# Altium project CarrierBoard.PrjPcb
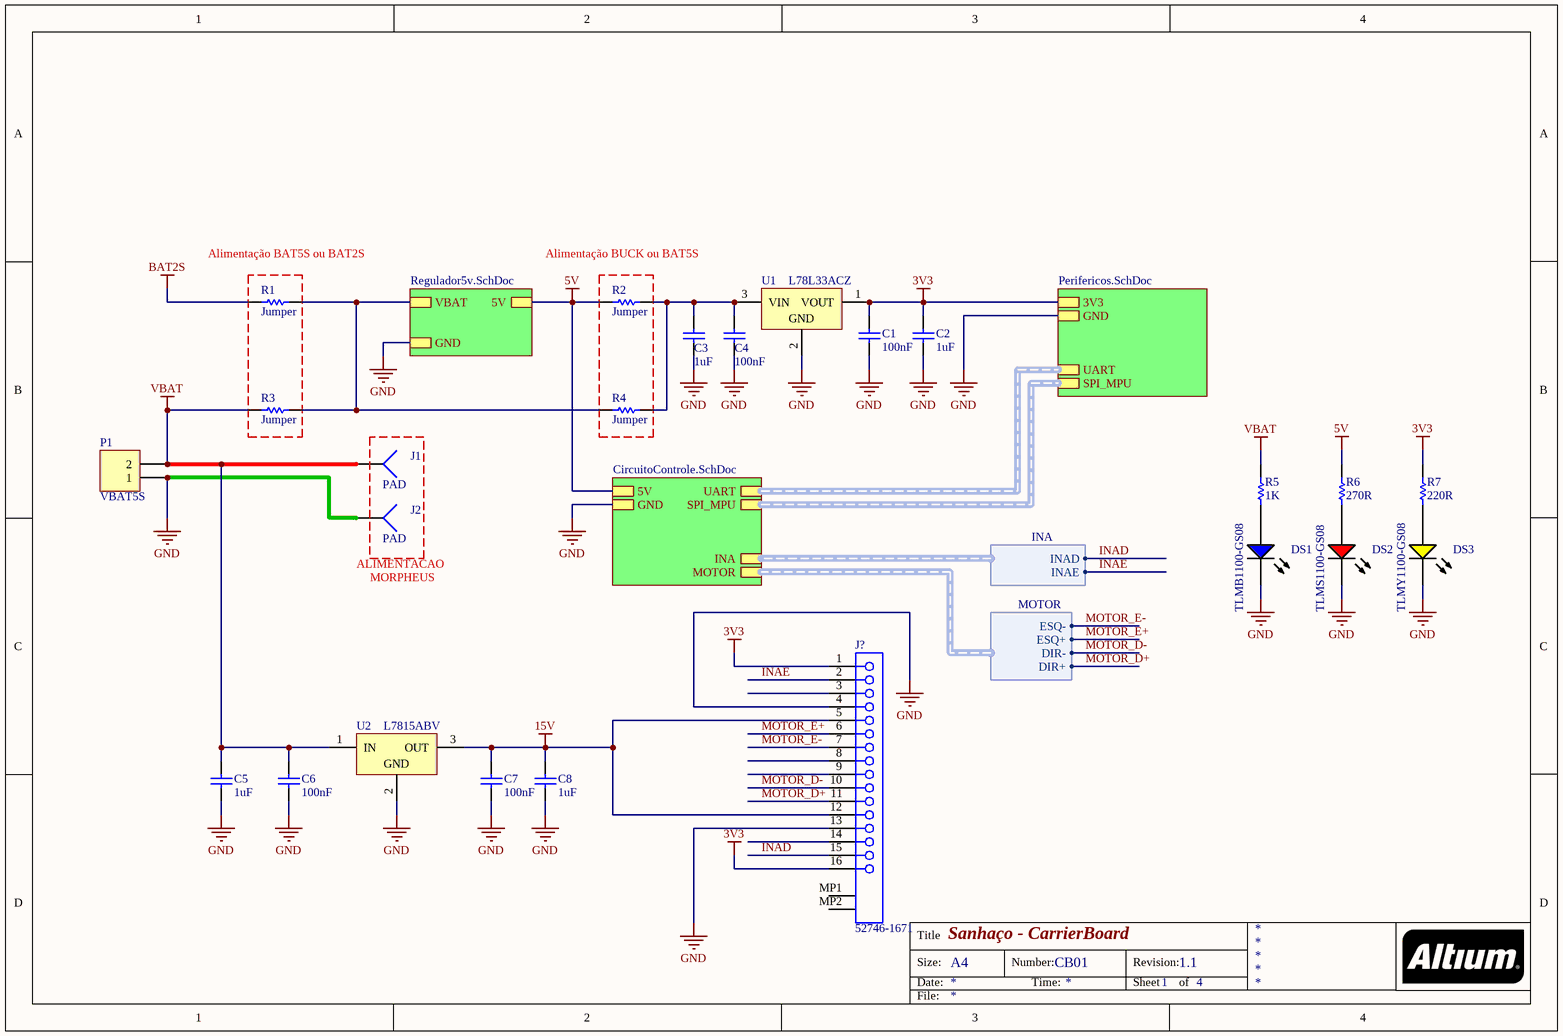
[diagram p0: CarrierBoard.SchDoc]
3 sheets, 55 parts. Net scope: hierarchical (ports join the sheet entries above them; power ports are global).
Sheets:
  CarrierBoard.SchDoc
    Designator = Regulador5V.SchDoc
    Designator = CircuitoControle.SchDoc

## Sheet CarrierBoard.SchDoc: Sanhaço - CarrierBoard
size A4; DocumentNumber: CB01; Revision: 1.1; SheetNumber: 1; SheetTotal: 4; ProjectName: CarrierBoard - Sanhaço

### Parts
C1  100nF  [CAPC0805(2012)145_N]
C2  1uF  [CAPC0805(2012)145_L]
C3  1uF  [CAPC0805(2012)145_L]
C4  100nF  [CAPC0805(2012)145_N]
C5  1uF  [CAPC0805(2012)145_L]
C6  100nF  [CAPC0805(2012)145_N]
C7  100nF  [CAPC0805(2012)145_N]
C8  1uF  [CAPC0805(2012)145_L]
DS1  TLMB1100-GS08  [VISH-TLMX1100-2_V]
DS2  TLMS1100-GS08  [VISH-TLMX1100_V]
DS3  TLMY1100-GS08  [VISH-TLMX1100-2_V]
J1  PAD  [PIN1]
J2  PAD  [PIN1]
J?  52746-1671  [MOLX-52746-1671]
P1  VBAT5S  [HDR1X2]
R1  Jumper  [RESC0805(2012)_N]
R2  Jumper  [RESC0805(2012)_N]
R3  Jumper  [RESC0805(2012)_N]
R4  Jumper  [RESC0805(2012)_N]
R5  1K  [RESC0805(2012)_N]
R6  270R  [RESC0402(1005)_N]
R7  220R  [RESC0805(2012)_N]
U1  L78L33ACZ  [TO-92]
U2  L7815ABV  [TO220]

### Sub-sheets
Designator = Regulador5v.SchDoc: VBAT, 5V, GND
Designator = Perifericos.SchDoc (file not in this document): 3V3, GND, SPI_MPU (harness SPI_MPU), UART (harness UART)
Designator = CircuitoControle.SchDoc: 5V, GND, UART (harness UART), SPI_MPU (harness SPI_MPU), MOTOR (harness MOTOR), INA (harness INA)

### Harnesses
INA: INAD, INAE
MOTOR: ESQ+, DIR-, DIR+, ESQ-

### Nets
3V3: C1.2 C2.2 J?.1 J?.16 R7.2 U1.1(VOUT) ; sheet Designator/3V3
5V: R2.1 R6.2 ; sheet Designator/5V, sheet Designator/5V
15V: C7.2 C8.2 J?.5 J?.12 U2.3(OUT)
BAT2S: R1.1
GND: C1.1 C2.1 C3.1 C4.1 C5.1 C6.1 C7.1 C8.1 DS1.2(K) DS2.2(K) DS3.2(K) J2.1 J?.4 J?.13 P1.1 U1.2(GND) U2.2(GND) ; sheet Designator/GND, sheet Designator/GND, sheet Designator/GND
VBAT: C5.2 C6.2 J1.1 P1.2 R3.1 R5.2 U2.1(IN)
INAD: J?.15 ; sheet Designator/INA.INAD
INAE: J?.2 ; sheet Designator/INA.INAE
MOTOR_D+: J?.11 ; sheet Designator/MOTOR.DIR+
MOTOR_D-: J?.10 ; sheet Designator/MOTOR.DIR-
MOTOR_E+: J?.6 ; sheet Designator/MOTOR.ESQ+
MOTOR_E-: J?.7 ; sheet Designator/MOTOR.ESQ-
NetC3_2: C3.2 C4.2 R2.2 R4.2 U1.3(VIN)
NetC13_2: R1.2 R3.2 R4.1 ; sheet Designator/VBAT
NetDS1_1: DS1.1(A) R5.1
NetDS2_1: DS2.1(A) R6.1
NetDS3_1: DS3.1(A) R7.1

Not connected (* = marked no-connect by the designer): J? 3 8 9 14 MP1 MP2

### Notes on the sheet
- (near R1) Alimentação BAT5S ou BAT2S
- (near R2) Alimentação BUCK ou BAT5S
- (near J2) ALIMENTACAO
- MORPHEUS
- Title
- Size:
- Date:
- A4
- Number:
- Time:
- Revision:
- Sheet
- of
- File:

### Library data of the parts
C1 C4 C6 C7 = CMP-1036-04417-1: CAP 100nF 50V ±5% 0805 (2012 Metric) Thickness 1.45mm SMD; Case-Metric: 2012; Tolerance: Â±5%; Case-EIA: 0805; Max Thickness: 1.45 mm; Rated Voltage: 50 V; Value: 100nF; Technology: SMT
C2 C3 C5 C8 = CMP-1036-04761-1: CAP 1uF 50V ±10% 0805 (2012 Metric) Thickness 1.45mm SMD; Tolerance: Â±10%; Case-EIA: 0805; Case-Metric: 2012; Technology: SMT; Value: 1uF; Max Thickness: 1.45 mm; Rated Voltage: 50 V
DS1 = CMP-1666-00028-1: Blue LED, 10 mA, 3.9 V, -40 to 100 degC, 2-Pin SMD (0603), RoHS, Tape and Reel                  TLMB1100-GS08; Tolerance: 10%; Voltage Rating: 100 V; Capacitance: 10 nF; Type (Capacitors): X7R; Case\Package: Radial; ComponentLink1Description: Manufacturer URL; REACH SVHC: No SVHC; Package Quantity: 500; PackageDescription: 2-Pin Surface Mount Device, Body 1.6 x 0.8 mm; Pins: 2; ComponentLink2URL: http://download.siliconexpert.com/pdfs/2016/8/7/12/43/26/667/vsh_/manual/379263299541529tlmb1100.pdf; RoHSCompliant: true; Lead Pitch: 2.54 mm; Height: 2.54 mm; DatasheetVersion: Rev. 2.7, 03/2016; Length: 5.33 mm; ComponentLink1URL: http://www.vishay.com/; Min Operating Temperature: -55 degC; PackageReference: 0603; Packaging: Bulk; ComponentLink2Description: Datasheet; Max Operating Temperature: 125 degC; Radiation Hardening: No; Width: 3.81 mm; Mount: Through Hole
DS2 = CMP-1666-00027-1: LED, RED, 2.1 V, -40 to 100 degC, 2-Pin SMD (0603), RoHS, Tape and Reel; Type (Capacitors): C0G; Resistance: 100000000000 Ohm; Capacitance: 12 pF; Voltage Rating: 50 V; Tolerance: 5%; Min Operating Temperature: -55degC; REACH SVHC: No SVHC; ComponentLink2Description: Datasheet; ComponentLink1URL: http://www.vishay.com/; Width: 0.8 mm; Package Quantity: 4000; PackageReference: TLMX1100; ComponentLink2URL: http://www.vishay.com/docs/83173/tlmb1100.pdf; Case/Package: 0603; Case Code (Metric): 1608; Packaging: Tape and Reel; Pins: 2; ComponentLink1Description: Manufacturer URL; Max Operating Temperature: 125degC; Height: 0.8 mm; Length: 1.6 mm; Mount: Surface Mount; PackageDescription: 2-Pin Surface Mount Device, Body 1.6 x 0.8 mm; DatasheetVersion: Rev. 2.7, 03/2016; Case Code (Imperial): 0603; Voltage Rating (DC): 50 V; RoHSCompliant: True; Radiation Hardening: No
DS3 = CMP-1666-00030-1: Yellow LED, 20 mA, 2.1 V, -40 to 100 degC, 2-Pin SMD (0603), RoHS, Tape and Reel             TLMY1100-GS08; ComponentLink2Description: Datasheet; ComponentLink2URL: http://download.siliconexpert.com/pdfs/2016/8/7/12/43/26/667/vsh_/manual/379263299541529tlmb1100.pdf; ComponentLink1Description: Manufacturer URL; PackageDescription: 2-Pin Surface Mount Device, Body 1.6 x 0.8 mm; DatasheetVersion: Rev. 2.7, 03/2016; ComponentLink1URL: http://www.vishay.com/; PackageReference: 0603
J1 J2 = Socket: LatestRevisionDate: 17-Jul-2002; LatestRevisionNote: Re-released for DXP Platform.; Publisher: Altium Limited
J? = CMP-1241-00378-1: 0.5 mm Pitch Easy-On(TM) Type FPC Connector, 2.0 mm Mated Height, Right Angle, ZIF, SMT, Bottom Contact, 16 Circuits, -20 to 85 degC, ELV and RoHS Compliant, Tape and Reel; Manufacturer: Molex; Voltage (Max): 50V; Durability (mating cycles max): 20; Current (Max per Contact): 0.5A; Pitch - Mating Interface: 0.50mm; PCB Retention: Yes; Stackable: No; Circuits (Loaded): 16; Material - Plating Termination: Gold; Mated Height: 2.00mm; Material - Metal: Phosphor Bronze; Entry Angle: 90degrees Angle; PackageVersion: Rev. H, 05/2009; ComponentLink1URL: http://www.molex.com/molex/index.jsp; PackageReference: 52746-1671; Contact Position: Bottom; Packing: Tape and Reel; Number of Rows: 1; ComponentLink1Description: Manufacturer URL; Mounting Technology: Surface Mount; RoHS: TRUE; Polarized to PCB: Yes; PackageDescription: 16-Lead FPC Connector, Pitch 0.5 mm; ComponentLink3Description: Package Specification; Material - Plating Mating: Gold; ComponentLink3URL: http://www.molex.com/pdm_docs/sd/527461671_sd.pdf; ComponentLink2Description: Datasheet; Orientation: Right Angle; PCB Locator: No; ComponentLink2URL: http://www.molex.com/webdocs/datasheets/pdf/en-us/0527461671_FFC_FPC_CONNECTORS.pdf; PartNumber: 52746-1671
P1 = Header 2: Header, 2-Pin; LatestRevisionDate: 17-Jul-2002; LatestRevisionNote: Re-released for DXP Platform.; Publisher: Altium Limited
R1-R4 = CMP-1013-00001-1: Jumper 0805 (2012 Metric); Case-EIA: 0805; Value: 0.00 Ohm; Tolerance: None; Case-Metric: 2012; Technology: SMT; Power: None
R5 = CMP-1013-00074-1: 1K 0.125W 5% 0805 (2012 Metric)  SMD                                667-ERJ-P06J102V; Case-EIA: 0805; Case-Metric: 2012; Power: 0.500 W; Value: 1000.00 Ohm; Technology: SMT; Tolerance: 5 %
R6 = CMP-1011-00060-1: 270R 0.063W 5% 0402 (1005 Metric)  SMD                             603-AC0402JR-07270RL; Case-Metric: 1005; Value: 270.00 Ohm; Case-EIA: 0402; Tolerance: 5 %; Technology: SMT; Power: 0.063 W
R7 = CMP-1013-00058-1: 220R 0.125W 5% 0805 (2012 Metric)  SMD                               603-RC0805JR-7W220RL; Power: 0.250 W; Value: 220.00 Ohm; Case-Metric: 2012; Case-EIA: 0805; Technology: SMT; Tolerance: 5 %
U1 = CMP-0244-00039-1: Positive Voltage Regulator, 3.3V, 3-Pin TO-92; PackageDescription: TO, Flat Index; 3 In-Line, Axial Leads; Body Dia. 4.7mm; Lead Dia. 0.56 mm (max); ComponentLink1Description: Manufacturer URL; PackageVersion: 2011; ComponentLink2URL: http://www.st.com/internet/com/TECHNICAL_RESOURCES/TECHNICAL_LITERATURE/DATASHEET/CD00000446.pdf; ComponentLink1URL: http://www.st.com; PackageReference: TO-92; DatasheetVersion: 1/02/2011; ComponentLink2Description: Datasheet
U2 = CMP-0244-00468-1: Positive Voltage Regulator, 15V, 3-Pin TO-220; ComponentLink1URL: http://www.st.com; ComponentLink3Description: Package Specification; ComponentLink3URL: http://www.st.com/internet/com/TECHNICAL_RESOURCES/TECHNICAL_LITERATURE/PACKAGE_INFORMATION/CD00004649.pdf; DatasheetVersion: 16/11/2011; ComponentLink2URL: http://www.st.com/internet/com/TECHNICAL_RESOURCES/TECHNICAL_LITERATURE/DATASHEET/CD00000444.pdf; PackageDescription: TO, Thru-Hole, Vertical, Heatsink Mounted; 3 In-Line Leads; Pitch 2.54 mm; ComponentLink1Description: Manufacturer URL; PackageVersion: ver3.0; ComponentLink2Description: Datasheet; PackageReference: TO220

## Sheet Regulador5V.SchDoc: Sanhaço - Regulador 5v
size A4; DocumentNumber: CB02; Revision: 1.1; SheetNumber: 2; SheetTotal: 4; ProjectName: Sanhaço
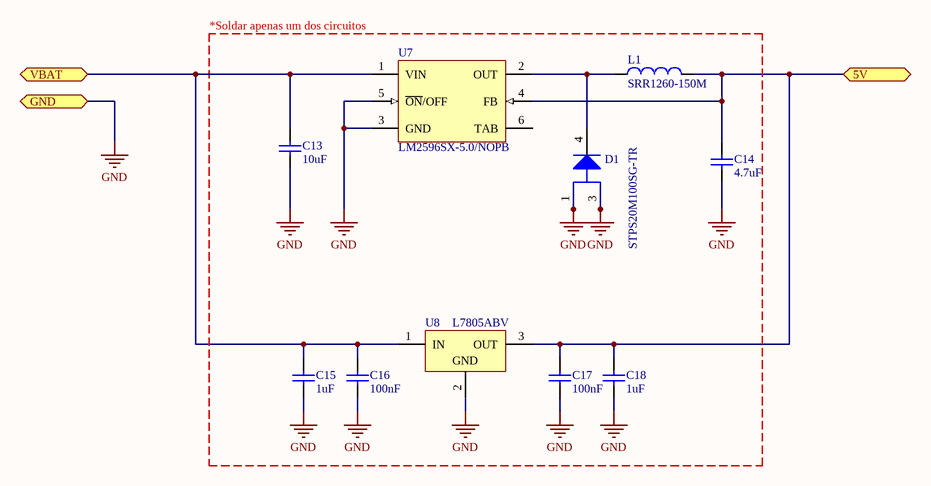
[diagram p1: Regulador5V.SchDoc]

### Parts
C13  10uF  [CAPC1206(3216)190_N]
C14  4.7uF  [CAPC0805(2012)145_N]
C15  1uF  [CAPC0805(2012)145_L]
C16  100nF  [CAPC0805(2012)145_N]
C17  100nF  [CAPC0805(2012)145_N]
C18  1uF  [CAPC0805(2012)145_L]
D1  STPS20M100SG-TR  [ONSC-D2PAK-3-418B-04_J_V]
L1  SRR1260-150M  [BOUR-SRR1260_V]
U7  LM2596SX-5.0/NOPB  [TS5B_M]
U8  L7805ABV  [TO220]

### Blocks framed on the sheet
*Soldar apenas um dos circuitos: C13-C18 D1 L1 U7 U8

### Ports
5V, GND, VBAT

### Nets
5V: C14.2 C17.2 C18.2 L1.2 U7.4(FB) U8.3(OUT) ; port 5V
GND: C13.1 C14.1 C15.1 C16.1 C17.1 C18.1 D1.1(A) D1.3(A) U7.3(GND) U7.5(~{ON}/OFF) U8.2(GND) ; port GND
NetC13_2: C13.2 C15.2 C16.2 U7.1(VIN) U8.1(IN) ; port VBAT
NetD1_4: D1.4(K) L1.1 U7.2(OUT)

Not connected (* = marked no-connect by the designer): U7 6(TAB)

### Notes on the sheet
- Title
- Size:
- Date:
- A4
- Number:
- Time:
- Revision:
- Sheet
- of
- File:

### Library data of the parts
C13 = CMP-1037-04983-1: CAP 10uF 50V ±20% 1206 (3216 Metric) Thickness 1.9mm SMD; Tolerance: Â±20%; Case-Metric: 3216; Case-EIA: 1206; Technology: SMT; Max Thickness: 1.9 mm; Rated Voltage: 50 V; Value: 10uF
C14 = CMP-1036-04896-1: CAP 4.7uF 25V ±20% 0805 (2012 Metric) Thickness 1.45mm SMD; Case-Metric: 2012; Tolerance: Â±20%; Case-EIA: 0805; Value: 4.7uF; Max Thickness: 1.45 mm; Technology: SMT; Rated Voltage: 25 V
C15 C18 = CMP-1036-04761-1: as C2 on sheet CarrierBoard; Technology: SMT; Value: 1uF; Max Thickness: 1.45 mm; Rated Voltage: 50 V
C16 C17 = CMP-1036-04417-1: as C1 on sheet CarrierBoard; Max Thickness: 1.45 mm; Rated Voltage: 50 V; Value: 100nF; Technology: SMT
D1 = CMP-1055-00080-1: SWITCHMODE(TM) Power Rectifier ORing Function Diode, 3-Pin D2PAK, Tape and Reel; Manufacturer: On Semiconductor; Configuration: Single; IFSM Max (A): 150; Voltagem: 455mV; PartNumber: STPS20M100SG-TR; PackageReference: D2PAK-3-418B-04_J; DatasheetVersion: Rev. 6; ComponentLink2URL: http://www.onsemi.cn/pub_link/Collateral/MBRB2515L-D.PDF; RoHS: FALSE; ComponentLink2Description: Datasheet; PackageDescription: 3-Pin D2PAK, Body 9.145 x 9.97 mm, Pitch 2.54 mm; ComponentLink1URL: http://www.onsemi.com/; Mounting Technology: Surface Mount; ComponentLink3Description: Package Specification; Packing: Tape and Reel; PackageVersion: Rev. J, 08/2004; ComponentLink1Description: Manufacturer URL; ComponentLink3URL: http://www.onsemi.com/pub_link/Collateral/BUB323Z-D.PDF
L1 = CMP-2000-07146-1: Shielded Power Inductor, 15 uH, +/- 20%, -40 to 125 degC, 2-Pin SMD, RoHS, Tape and Reel; Manufacturer: Bourns; Core Material: Ferrite; Inductance: 15uH; Product Height: 6.5mm; Maximum DC Current: 5A; Maximum DC Resistance: 27mOhm; Minimum Quality Factor: 25(Typ)@2.52MHz; Package Reference: SRR1260; Package Description: 2-Pin Surface Mount Device, Body 12.5 x 12.5 mm; Datasheet URL: http://www.bourns.com/docs/Product-Datasheets/SRR1260.pdf; Mounting Technology: SurfaceMount; Category: InductorSurfaceMount; Package/Case: 12.8X12.8X6.5; Manufacturer URL: http://www.bourns.com/; Datasheet Version: 03/2015; Tolerance: 20%; Type: Power
U7 = CMP-0069-00282-2: SIMPLE SWITCHER® Power Converter 150 KHz 3A Step-Down Voltage Regulator, 5-pin TO-263; Manufacturer: Texas Instruments; PowerWise: N; PackageTopMarking: NSUZXYTTE#*LM2596S*-5.0 P+; RevisionNote: Component URLs added; ComponentLink3URL: http://www.national.com/packaging/folders/ts5b.html; Code_JEDEC: MO-169-AB; ComponentLink1Description: LM2596 Datasheet; DatasheetVersion: May-2002; ComponentLink2Description: LM2596 Web Page; PackageReference: TS5B; PackageDescription: TO-263, Molded, .400 x .390 x .180in, 5 Lead, .067in Pitch, Surface Mount; CompType: Switcher; ComponentLink1URL: http://www.national.com/ds/LM/LM2596.pdf; ComponentLink3Description: TS5B Package Page; PinCount: 5; RoHS: N; ComponentLink2URL: http://www.national.com/pf/LM/LM2596.html
U8 = CMP-0244-00485-1: Positive Voltage Regulator, 5V, 3-Pin TO-220; ComponentLink1URL: http://www.st.com; PackageDescription: TO, Thru-Hole, Vertical, Heatsink Mounted; 3 In-Line Leads; Pitch 2.54 mm; DatasheetVersion: 16/11/2011; ComponentLink2Description: Datasheet; ComponentLink1Description: Manufacturer URL; PackageReference: TO220; ComponentLink3Description: Package Specification; ComponentLink2URL: http://www.st.com/internet/com/TECHNICAL_RESOURCES/TECHNICAL_LITERATURE/DATASHEET/CD00000444.pdf; ComponentLink3URL: http://www.st.com/internet/com/TECHNICAL_RESOURCES/TECHNICAL_LITERATURE/PACKAGE_INFORMATION/CD00004649.pdf; PackageVersion: ver3.0

## Sheet CircuitoControle.SchDoc: Sanhaço - Ckt Controle
size A4; DocumentNumber: CB03; Revision: 1.1; SheetNumber: 3; SheetTotal: 4
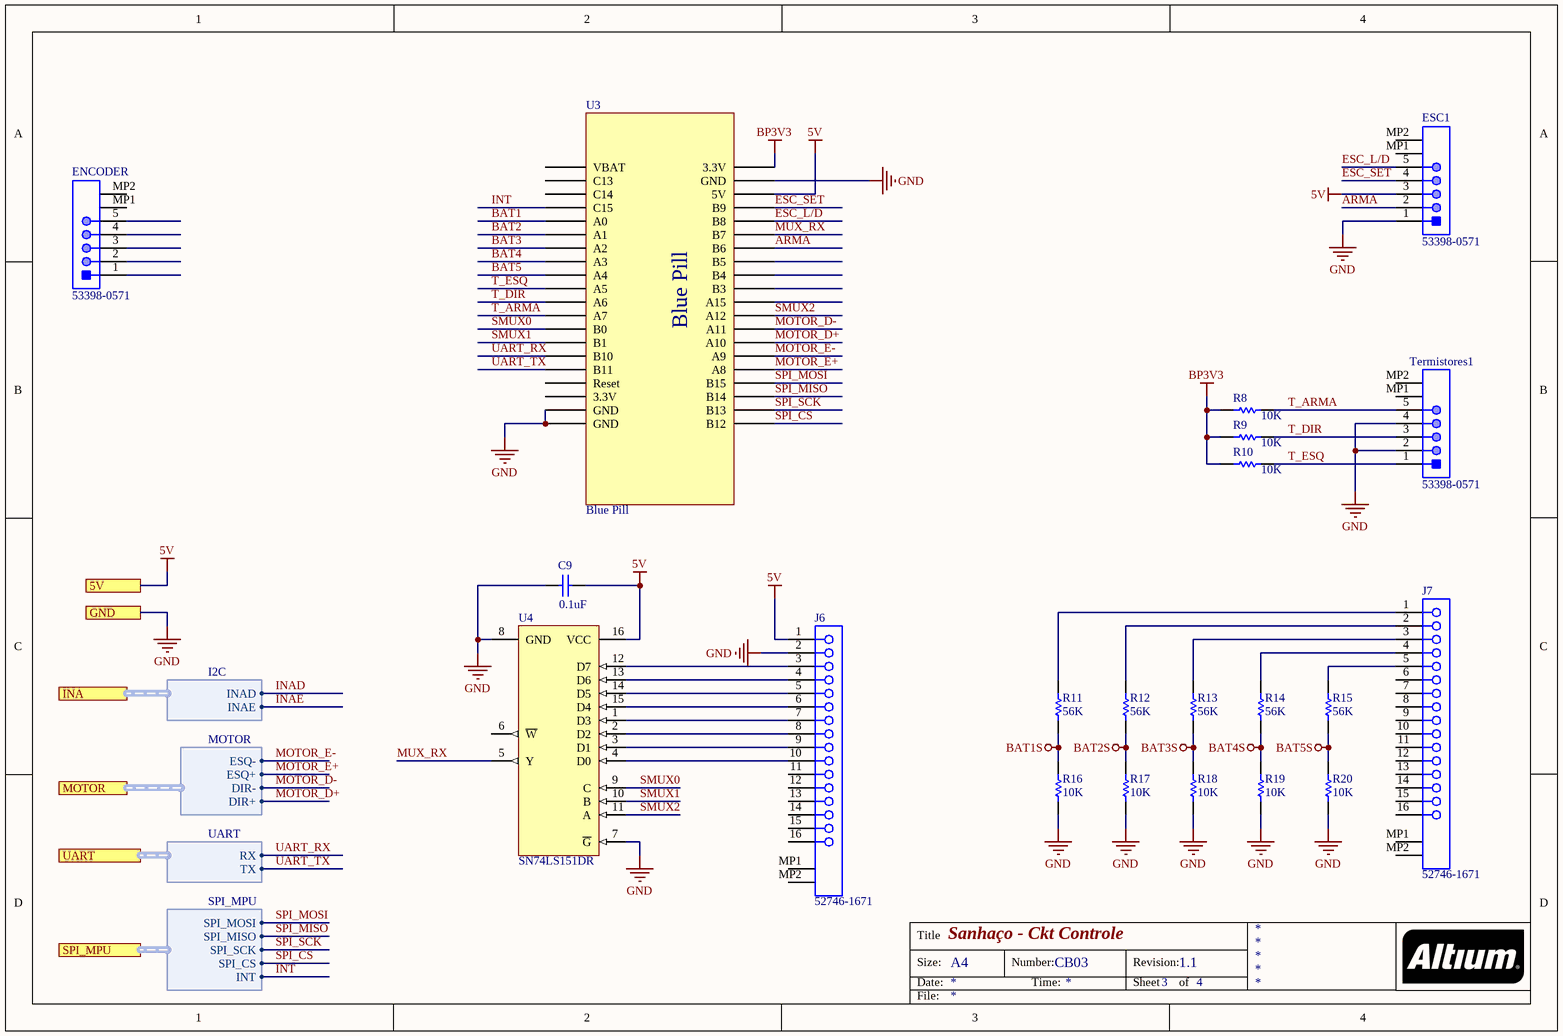
[diagram p2: CircuitoControle.SchDoc]

### Parts
C9  Capacitance Value: 0.1uF  [CAPC1608X90X30LL10T20]  (hidden comment: 710-885012206071)
ENCODER  53398-0571  [MOLX-53398-0571-5_V]
ESC1  53398-0571  [MOLX-53398-0571-5_V]
J6  52746-1671  [MOLX-52746-1671]
J7  52746-1671  [MOLX-52746-1671]
R8  10K  [RESC0402(1005)_L]
R9  10K  [RESC0402(1005)_L]
R10  10K  [RESC0402(1005)_L]
R11  56K  [RESC0402(1005)_N]
R12  56K  [RESC0402(1005)_N]
R13  56K  [RESC0402(1005)_N]
R14  56K  [RESC0402(1005)_N]
R15  56K  [RESC0402(1005)_N]
R16  10K  [RESC0402(1005)_L]
R17  10K  [RESC0402(1005)_L]
R18  10K  [RESC0402(1005)_L]
R19  10K  [RESC0402(1005)_L]
R20  10K  [RESC0402(1005)_L]
Termistores1  53398-0571  [MOLX-53398-0571-5_V]
U3  Blue Pill  [blue pill]
U4  SN74LS151DR  [D0016A_L]

### Ports
5V, GND, INA (harness I2C), MOTOR (harness MOTOR), SPI_MPU (harness SPI_MPU), UART (harness UART)

### Harnesses
UART: RX, TX
SPI_MPU: SPI_MOSI, SPI_MISO, SPI_SCK, SPI_CS, INT
I2C: INAD, INAE
MOTOR: ESQ+, DIR-, DIR+, ESQ-

### Nets
5V: C9.2 ESC1.3 J6.1 U3.?38(5V) U4.16(VCC) ; port 5V
BAT1S: R11.1 R16.2
BAT2S: R12.1 R17.2
BAT3S: R13.1 R18.2
BAT4S: R14.1 R19.2
BAT5S: R15.1 R20.2
BP3V3: R8.2 R9.2 R10.2 U3.?40(3.3V)
GND: C9.1 ESC1.1 J6.2 R16.1 R17.1 R18.1 R19.1 R20.1 Termistores1.2 Termistores1.4 U3.?19(GND) U3.?20(GND) U3.?39(GND) U4.7(~{G}) U4.8(GND) ; port GND
ARMA: ESC1.2 U3.?34(B6)
BAT1: U3.?6(A0)
BAT2: U3.?7(A1)
BAT3: U3.?8(A2)
BAT4: U3.?9(A3)
BAT5: U3.?10(A4)
ESC_L/D: ESC1.5 U3.?36(B8)
ESC_SET: ESC1.4 U3.?37(B9)
INT: U3.?5(C15) ; port SPI_MPU.INT
MOTOR_D+: U3.?27(A10) ; port MOTOR.DIR+
MOTOR_D-: U3.?28(A11) ; port MOTOR.DIR-
MOTOR_E+: U3.?25(A8) ; port MOTOR.ESQ+
MOTOR_E-: U3.?26(A9) ; port MOTOR.ESQ-
MUX_RX: U3.?35(B7) U4.5(Y)
SMUX0: U3.?14(B0) U4.9(C)
SMUX1: U3.?15(B1) U4.10(B)
SMUX2: U3.?29(A12) U4.11(A)
SPI_CS: U3.?21(B12) ; port SPI_MPU.SPI_CS
SPI_MISO: U3.?23(B14) ; port SPI_MPU.SPI_MISO
SPI_MOSI: U3.?24(B15) ; port SPI_MPU.SPI_MOSI
SPI_SCK: U3.?22(B13) ; port SPI_MPU.SPI_SCK
T_ARMA: R8.1 Termistores1.5 U3.?13(A7)
T_DIR: R9.1 Termistores1.3 U3.?12(A6)
T_ESQ: R10.1 Termistores1.1 U3.?11(A5)
UART_RX: U3.?16(B10) ; port UART.RX
UART_TX: U3.?17(B11) ; port UART.TX
NetJ6_3: J6.3 U4.12(D7)
NetJ6_4: J6.4 U4.13(D6)
NetJ6_5: J6.5 U4.14(D5)
NetJ6_6: J6.6 U4.15(D4)
NetJ6_7: J6.7 U4.1(D3)
NetJ6_8: J6.8 U4.2(D2)
NetJ6_9: J6.9 U4.3(D1)
NetJ6_10: J6.10 U4.4(D0)
NetJ7_1: J7.1 R11.2
NetJ7_2: J7.2 R12.2
NetJ7_3: J7.3 R13.2
NetJ7_4: J7.4 R14.2
NetJ7_5: J7.5 R15.2

Not connected (* = marked no-connect by the designer): ENCODER 1 2 3 4 5 MP1 MP2; ESC1 MP1 MP2; J6 11 12 13 14 15 16 MP1 MP2; J7 6 7 8 9 10 11 12 13 14 15 16 MP1 MP2; Termistores1 MP1 MP2; U3 ?1(VBAT) ?2(3.3V) ?3(C13) ?4(C14) ?18(Reset) ?30(A15) ?31(B3) ?32(B4) ?33(B5); U4 6(~{W})

### Notes on the sheet
- Title
- Size:
- Date:
- A4
- Number:
- Time:
- Revision:
- Sheet
- of
- File:

### Library data of the parts
C9 = CMP-2000-06092-1: Chip Capacitor, 100 nF, +/- 10%, 50 V, -55 to 125 degC, 0603 (1608 Metric), RoHS, Tape and Reel               710-885012206071; Manufacturer: SamsungElectro-Mechanics; Product Length: 1.6mm; Voltage: 25Vdc; Product Height: 0.8mm; Rad Hard: No; Dielectric: X7R; Packaging: Tape&Reel; Package Description: 2-Pin Surface Mount Device, Body 1.60 x 0.80 mm; Package Reference: 0603; Datasheet Version: 06/2016; Operating Temperature: -55to125°C; Category: CapacitorCeramicMultilayer; Product Depth: 0.8mm; Mounting Technology: SurfaceMount; Package/Case: 0603; Tolerance: 10%; Construction: Flat; Mounting: SurfaceMount; Datasheet URL: https://br.mouser.com/datasheet/2/445/885012206071-554587.pdf
ENCODER Termistores1 = CMP-2000-05250-1: Male Header, Pitch 1.25 mm, 1 x 5 Postion, Height 4.7 mm, -40 to 85 degC, RoHS, Tape and Reel; Brand: Molex; Number of Positions: 5Position; Mounting Angle: Vertical; Current Rating: 1A; Pitch: 1.25mm; Voltage Rating: 125V; Type: Shrouded; Tradename: PicoBlade; Datasheet Version: Rev. E, 04/2006; Housing Material: Nylon; Datasheet URL: http://www.molex.com/pdm_docs/sd/533980571_sd.pdf; Termination Style: SMD; Contact Gender: Pin(Male); Factory Pack Quantity: 1000; Number of Rows: 1Row; Product: Headers; Package Reference: MOLX-53398-0571-5; Contact Material: PhosphorBronze; RoHS: Details; Manufacturer URL: http://www.molex.com/; Product Category: Headers&WireHousings; Contact Plating: Tin; Manufacturer: Molex; Series: 53398; Packaging: Reel; Mounting Style: SMD
ESC1 = CMP-2000-05250-1: Brand: Molex; Number of Positions: 5Position; Mounting Angle: Vertical; Current Rating: 1A; Pitch: 1.25mm; Voltage Rating: 125V; Type: Shrouded; Tradename: PicoBlade; Datasheet Version: Rev. E, 04/2006; Housing Material: Nylon; Datasheet URL: http://www.molex.com/pdm_docs/sd/533980571_sd.pdf; Termination Style: SMD; Contact Gender: Pin(Male); Factory Pack Quantity: 1000; Number of Rows: 1Row; Product: Headers; Package Reference: MOLX-53398-0571-5; Contact Material: PhosphorBronze; RoHS: Details; Manufacturer URL: http://www.molex.com/; Product Category: Headers&WireHousings; Contact Plating: Tin; Manufacturer: Molex; Series: 53398; Packaging: Reel; Mounting Style: SMD
J6 J7 = CMP-1241-00378-1: as J? on sheet CarrierBoard; PackageVersion: Rev. H, 05/2009; ComponentLink1URL: http://www.molex.com/molex/index.jsp; PackageReference: 52746-1671; Contact Position: Bottom; Packing: Tape and Reel; Number of Rows: 1; ComponentLink1Description: Manufacturer URL; Mounting Technology: Surface Mount; RoHS: TRUE; Polarized to PCB: Yes; PackageDescription: 16-Lead FPC Connector, Pitch 0.5 mm; ComponentLink3Description: Package Specification; Material - Plating Mating: Gold; ComponentLink3URL: http://www.molex.com/pdm_docs/sd/527461671_sd.pdf; ComponentLink2Description: Datasheet; Orientation: Right Angle; PCB Locator: No; ComponentLink2URL: http://www.molex.com/webdocs/datasheets/pdf/en-us/0527461671_FFC_FPC_CONNECTORS.pdf; PartNumber: 52746-1671
R8-R10 = CMP-1011-00623-1: 10K 0.063W 1% 0402 (1005 Metric)  SMD                                    71-CRCW040210K0FKEDC; Case-Metric: 1005; Value: 10000.00 Ohm; Case-EIA: 0402; Tolerance: 1 %; Technology: SMT; Power: 0.063 W
R11-R15 = CMP-1011-00708-1: 56K 0.063W 1% 0402 (1005 Metric)  SMD; Value: 56000.00 Ohm; Case-EIA: 0402; Case-Metric: 1005; Tolerance: 1 %; Power: 0.063 W; Technology: SMT
R16-R20 = CMP-1011-00623-1: 10K 0.063W 1% 0402 (1005 Metric)  SMD                                         71-CRCW040210K0FKEDC; Case-Metric: 1005; Value: 10000.00 Ohm; Case-EIA: 0402; Tolerance: 1 %; Technology: SMT; Power: 0.063 W
U4 = CMP-1633-00148-1: 8-Line To 1-Line Data Selectors/Multiplexers, D0016A, LARGE T&R; Manufacturer: Texas Instruments; VCC(Max)(V): 5.25; Configuration: "16","1"; Channels(#): 1; F @ Nom Voltage(Max)(Mhz): 35; Input Type: TTL; Output Drive (IOL/IOH)(Max)(mA): 8/-0.4; Voltage(Nom)(V): 5; Bits(#): 16; VCC(Min)(V): 4.75; Technology Family: LS; tpd @ Nom Voltage(Max)(ns): 38; Function: Encoder/Multiplexer; Schmitt Trigger: No; Rating: Catalog; ICC @ Nom Voltage(Max)(mA): 10; PartNumber: SN74LS151DR; Operating Temperature Range(C): 0 to 70; Type: Standard; ComponentLink3URL: http://www.ti.com/lit/ml/mpds178g/mpds178g.pdf; ComponentLink1Description: Manufacturer URL; ComponentLink2Description: Datasheet; DatasheetVersion: SDLS054; Output Type: TTL; PackageReference: D0016A; ComponentLink1URL: http://www.ti.com/; Code_JEDEC: MS-012 variation AC; ComponentLink2URL: http://www.ti.com/lit/ds/symlink/sn74ls151.pdf; ComponentLink3Description: Package Specification; Generic Part Number: SN74LS151

## Nets that join several sheets
5V: CarrierBoard (R2.1 R6.2), Regulador5V (6 pins), CircuitoControle (5 pins)
BAT2S: CarrierBoard (R1.1), CircuitoControle (R12.1 R17.2)
GND: CarrierBoard (17 pins), Regulador5V (11 pins), CircuitoControle (15 pins)
MOTOR_D+: CarrierBoard (J?.11), CircuitoControle (U3.?27)
MOTOR_D-: CarrierBoard (J?.10), CircuitoControle (U3.?28)
MOTOR_E+: CarrierBoard (J?.6), CircuitoControle (U3.?25)
MOTOR_E-: CarrierBoard (J?.7), CircuitoControle (U3.?26)
NetC13_2: CarrierBoard (R1.2 R3.2 R4.1), Regulador5V (5 pins)